# EAGLE design shield-p1000 (EAGLE 9.7.0)
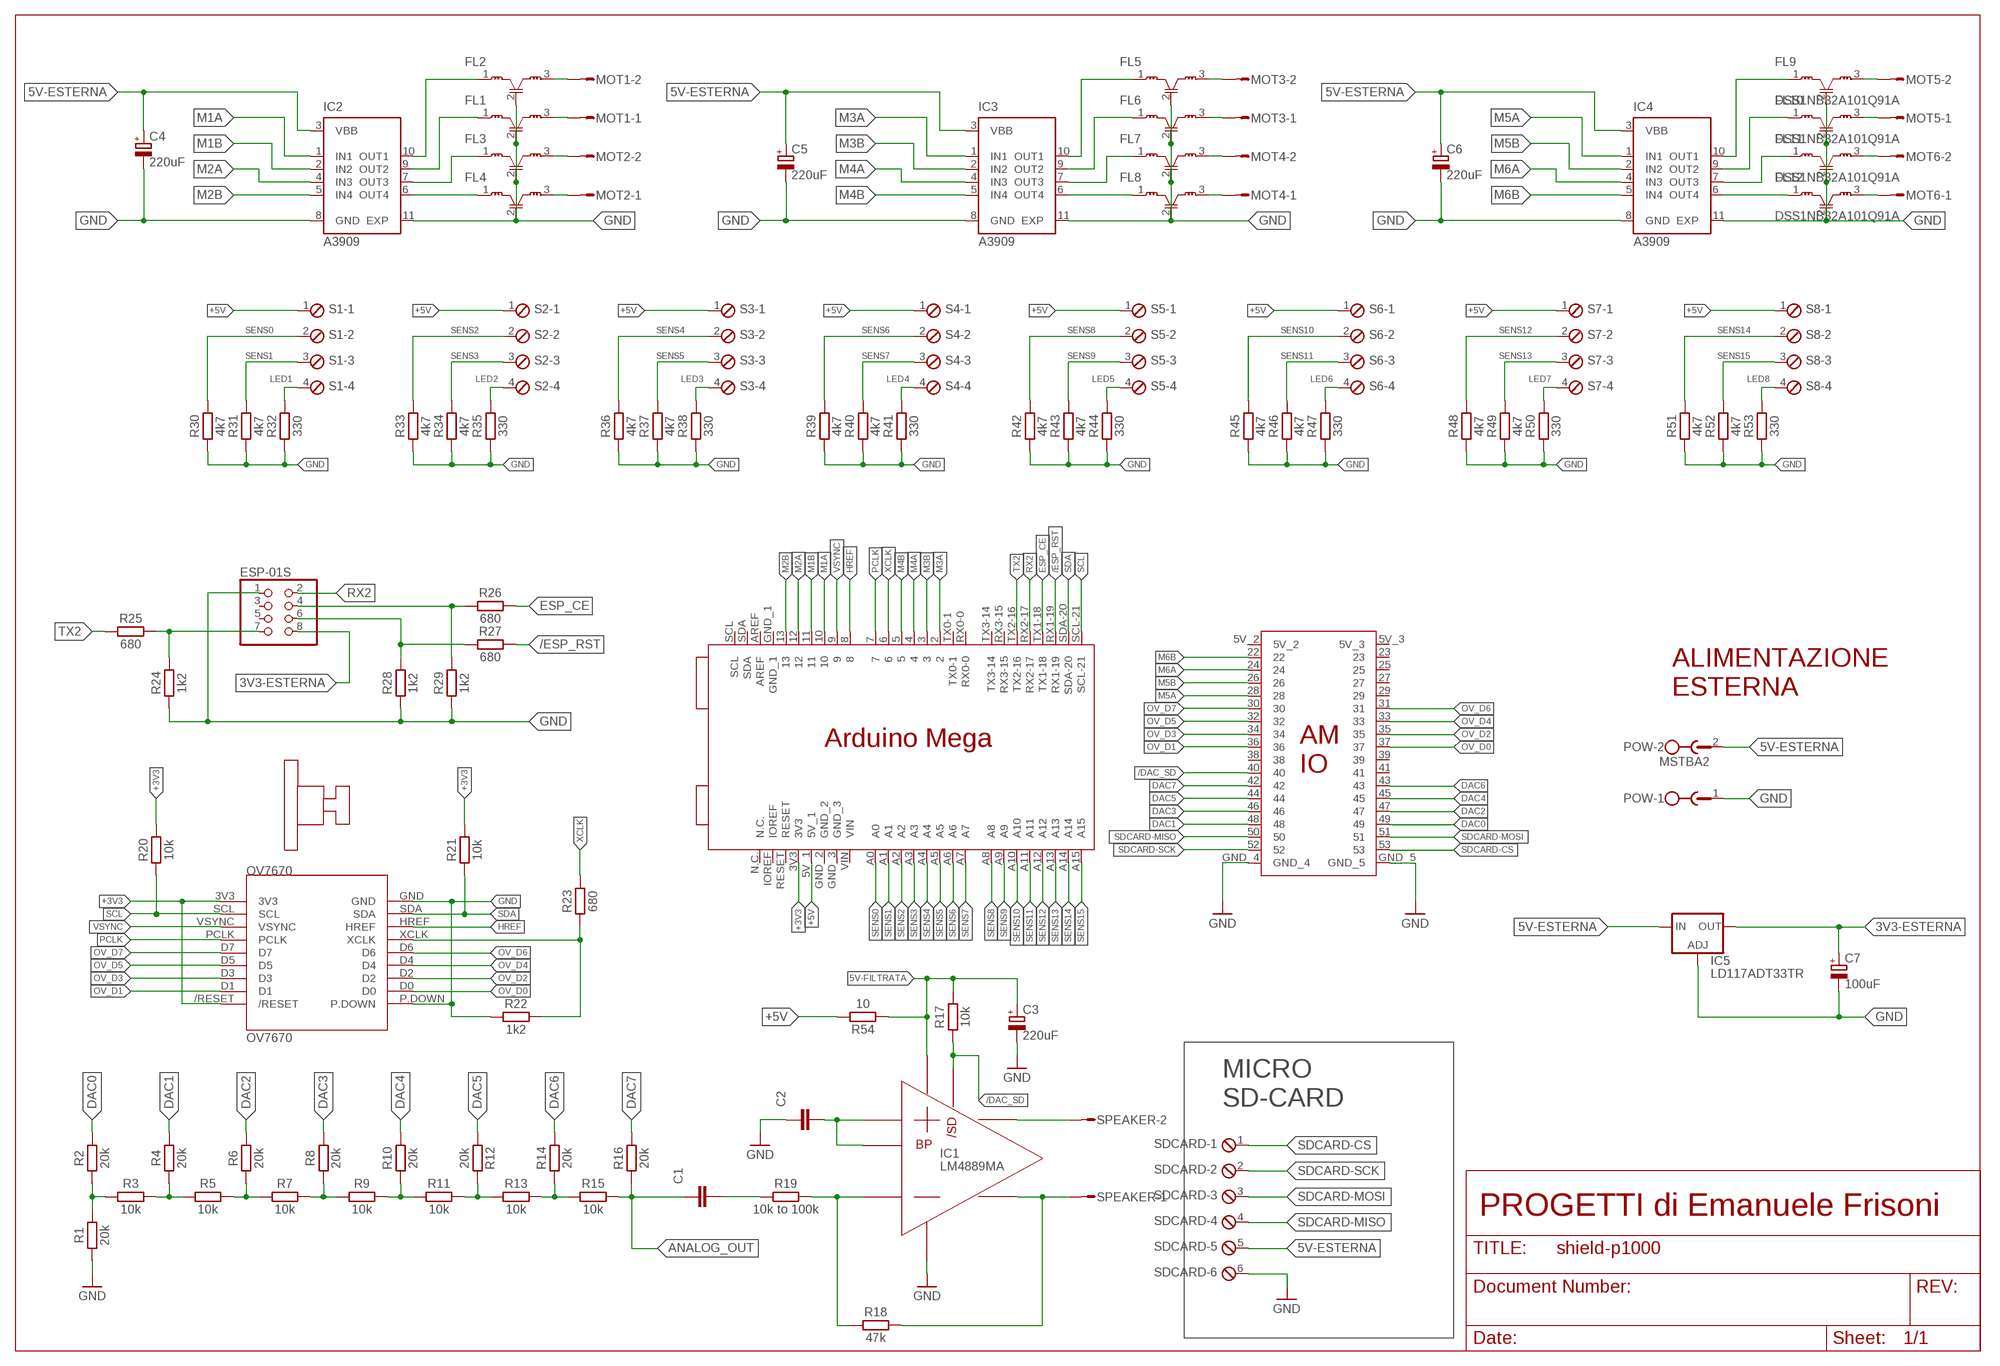
[diagram p0: schematic, sheet 1]

## Parts
ARDUINO-MEGA1  ARDUINO-MEGA-SH  [ARDUINO-MEGA-SH]
C1  1uF  C_CHIP-0603(1608-METRIC)  [CAPC1608X85]
C2  1uF  C_CHIP-0603(1608-METRIC)  [CAPC1608X85]
C3  220uF  CPOL-EUE3.5-10  [E3,5-10]
C4  220uF  CPOL-EUE3.5-10  [E3,5-10]
C5  220uF  CPOL-EUE3.5-10  [E3,5-10]
C6  220uF  CPOL-EUE3.5-10  [E3,5-10]
C7  100uF  CPOL-EUE3.5-10  [E3,5-10]
ESP-01S  PINHD-2X4  [2X04]
FL1  DSS1NB32A101Q91A  [RADIAL-3]
FL2  DSS1NB32A101Q91A  [RADIAL-3]
FL3  DSS1NB32A101Q91A  [RADIAL-3]
FL4  DSS1NB32A101Q91A  [RADIAL-3]
FL5  DSS1NB32A101Q91A  [RADIAL-3]
FL6  DSS1NB32A101Q91A  [RADIAL-3]
FL7  DSS1NB32A101Q91A  [RADIAL-3]
FL8  DSS1NB32A101Q91A  [RADIAL-3]
FL9  DSS1NB32A101Q91A  [RADIAL-3]
FL10  DSS1NB32A101Q91A  [RADIAL-3]
FL11  DSS1NB32A101Q91A  [RADIAL-3]
FL12  DSS1NB32A101Q91A  [RADIAL-3]
IC1  LM4889MA  [SOIC127P599X175-8N]
IC2  A3909  A3909LY  [10-MSOP]
IC3  A3909  A3909LY  [10-MSOP]
IC4  A3909  A3909LY  [10-MSOP]
IC5  LD117ADT33TR  [DPACK]
MOT1  S02P  [S02P]
MOT2  S02P  [S02P]
MOT3  S02P  [S02P]
MOT4  S02P  [S02P]
MOT5  S02P  [S02P]
MOT6  S02P  [S02P]
OV7670  OV7670  [OV7670-HEADER]
POW  MSTBA2  [MSTBA2]
R1  20k  R_CHIP-0603(1608-METRIC)  [RESC1608X60]
R2  20k  R_CHIP-0603(1608-METRIC)  [RESC1608X60]
R3  10k  R_CHIP-0603(1608-METRIC)  [RESC1608X60]
R4  20k  R_CHIP-0603(1608-METRIC)  [RESC1608X60]
R5  10k  R_CHIP-0603(1608-METRIC)  [RESC1608X60]
R6  20k  R_CHIP-0603(1608-METRIC)  [RESC1608X60]
R7  10k  R_CHIP-0603(1608-METRIC)  [RESC1608X60]
R8  20k  R_CHIP-0603(1608-METRIC)  [RESC1608X60]
R9  10k  R_CHIP-0603(1608-METRIC)  [RESC1608X60]
R10  20k  R_CHIP-0603(1608-METRIC)  [RESC1608X60]
R11  10k  R_CHIP-0603(1608-METRIC)  [RESC1608X60]
R12  20k  R_CHIP-0603(1608-METRIC)  [RESC1608X60]
R13  10k  R_CHIP-0603(1608-METRIC)  [RESC1608X60]
R14  20k  R_CHIP-0603(1608-METRIC)  [RESC1608X60]
R15  10k  R_CHIP-0603(1608-METRIC)  [RESC1608X60]
R16  20k  R_CHIP-0603(1608-METRIC)  [RESC1608X60]
R17  10k  R_CHIP-0603(1608-METRIC)  [RESC1608X60]
R18  47k  R_CHIP-0603(1608-METRIC)  [RESC1608X60]
R19  10k to 100k  R_AXIAL-7.2MM-PITCH  [RESAD724W46L381D178B]
R20  10k  R_CHIP-0603(1608-METRIC)  [RESC1608X60]
R21  10k  R_CHIP-0603(1608-METRIC)  [RESC1608X60]
R22  1k2  R_CHIP-0603(1608-METRIC)  [RESC1608X60]
R23  680  R_CHIP-0603(1608-METRIC)  [RESC1608X60]
R24  1k2  R_CHIP-0603(1608-METRIC)  [RESC1608X60]
R25  680  R_CHIP-0603(1608-METRIC)  [RESC1608X60]
R26  680  R_CHIP-0603(1608-METRIC)  [RESC1608X60]
R27  680  R_CHIP-0603(1608-METRIC)  [RESC1608X60]
R28  1k2  R_CHIP-0603(1608-METRIC)  [RESC1608X60]
R29  1k2  R_CHIP-0603(1608-METRIC)  [RESC1608X60]
R30  4k7  R_CHIP-0603(1608-METRIC)  [RESC1608X60]
R31  4k7  R_CHIP-0603(1608-METRIC)  [RESC1608X60]
R32  330  R_CHIP-0603(1608-METRIC)  [RESC1608X60]
R33  4k7  R_CHIP-0603(1608-METRIC)  [RESC1608X60]
R34  4k7  R_CHIP-0603(1608-METRIC)  [RESC1608X60]
R35  330  R_CHIP-0603(1608-METRIC)  [RESC1608X60]
R36  4k7  R_CHIP-0603(1608-METRIC)  [RESC1608X60]
R37  4k7  R_CHIP-0603(1608-METRIC)  [RESC1608X60]
R38  330  R_CHIP-0603(1608-METRIC)  [RESC1608X60]
R39  4k7  R_CHIP-0603(1608-METRIC)  [RESC1608X60]
R40  4k7  R_CHIP-0603(1608-METRIC)  [RESC1608X60]
R41  330  R_CHIP-0603(1608-METRIC)  [RESC1608X60]
R42  4k7  R_CHIP-0603(1608-METRIC)  [RESC1608X60]
R43  4k7  R_CHIP-0603(1608-METRIC)  [RESC1608X60]
R44  330  R_CHIP-0603(1608-METRIC)  [RESC1608X60]
R45  4k7  R_CHIP-0603(1608-METRIC)  [RESC1608X60]
R46  4k7  R_CHIP-0603(1608-METRIC)  [RESC1608X60]
R47  330  R_CHIP-0603(1608-METRIC)  [RESC1608X60]
R48  4k7  R_CHIP-0603(1608-METRIC)  [RESC1608X60]
R49  4k7  R_CHIP-0603(1608-METRIC)  [RESC1608X60]
R50  330  R_CHIP-0603(1608-METRIC)  [RESC1608X60]
R51  4k7  R_CHIP-0603(1608-METRIC)  [RESC1608X60]
R52  4k7  R_CHIP-0603(1608-METRIC)  [RESC1608X60]
R53  330  R_CHIP-0603(1608-METRIC)  [RESC1608X60]
R54  10  R_CHIP-0603(1608-METRIC)  [RESC1608X60]
S1  MPT4  [4POL254]
S2  MPT4  [4POL254]
S3  MPT4  [4POL254]
S4  MPT4  [4POL254]
S5  MPT4  [4POL254]
S6  MPT4  [4POL254]
S7  MPT4  [4POL254]
S8  MPT4  [4POL254]
SDCARD  MPT6  [6POL254]
SPEAKER  S02P  [S02P]

## Nets
3V3-ESTERNA: C7.+ ESP-01S.8 IC5.4(OUT)
5V-ESTERNA: C4.+ C5.+ C6.+ IC2.3(VBB) IC3.3(VBB) IC4.3(VBB) IC5.3(IN) POW.2 SDCARD.5
5V-FILTRATA: C3.+ IC1.6(VDD) R17.1 R54.2
+3V3: ARDUINO-MEGA1.3V3 OV7670.3V3 OV7670./RESET R20.2 R21.2
+5V: ARDUINO-MEGA1.5V_1 R54.1 S1.1 S2.1 S3.1 S4.1 S5.1 S6.1 S7.1 S8.1
/DAC_SD: ARDUINO-MEGA1.40 IC1.1(/SHUTDOWN) R17.2
/ESP_RST: ARDUINO-MEGA1.RX1-19 R27.2
ANALOG_OUT: C1.1 R15.1 R16.2
DAC0: ARDUINO-MEGA1.49 R2.1
DAC1: ARDUINO-MEGA1.48 R4.1
DAC2: ARDUINO-MEGA1.47 R6.1
DAC3: ARDUINO-MEGA1.46 R8.1
DAC4: ARDUINO-MEGA1.45 R10.1
DAC5: ARDUINO-MEGA1.44 R12.1
DAC6: ARDUINO-MEGA1.43 R14.1
DAC7: ARDUINO-MEGA1.42 R16.1
ESP_CE: ARDUINO-MEGA1.TX1-18 R26.2
GND: ARDUINO-MEGA1.GND_4 ARDUINO-MEGA1.GND_5 C2.1 C3.- C4.- C5.- C6.- C7.- ESP-01S.1 FL1.2(GND) FL2.2(GND) FL3.2(GND) FL4.2(GND) FL5.2(GND) FL6.2(GND) FL7.2(GND) FL8.2(GND) FL9.2(GND) FL10.2(GND) FL11.2(GND) FL12.2(GND) IC1.7(VSS) IC2.8(GND) IC2.11(EXP) IC3.8(GND) IC3.11(EXP) IC4.8(GND) IC4.11(EXP) IC5.1(ADJ) OV7670.GND OV7670.P.DOWN POW.1 R1.1 R22.1 R24.1 R28.1 R29.1 R30.1 R31.1 R32.1 R33.1 R34.1 R35.1 R36.1 R37.1 R38.1 R39.1 R40.1 R41.1 R42.1 R43.1 R44.1 R45.1 R46.1 R47.1 R48.1 R49.1 R50.1 R51.1 R52.1 R53.1 SDCARD.6
HREF: ARDUINO-MEGA1.8 OV7670.HREF
LED1: R32.2 S1.4
LED2: R35.2 S2.4
LED3: R38.2 S3.4
LED4: R41.2 S4.4
LED5: R44.2 S5.4
LED6: R47.2 S6.4
LED7: R50.2 S7.4
LED8: R53.2 S8.4
M1A: ARDUINO-MEGA1.10 IC2.1(IN1)
M1B: ARDUINO-MEGA1.11 IC2.2(IN2)
M2A: ARDUINO-MEGA1.12 IC2.4(IN3)
M2B: ARDUINO-MEGA1.13 IC2.5(IN4)
M3A: ARDUINO-MEGA1.2 IC3.1(IN1)
M3B: ARDUINO-MEGA1.3 IC3.2(IN2)
M4A: ARDUINO-MEGA1.4 IC3.4(IN3)
M4B: ARDUINO-MEGA1.5 IC3.5(IN4)
M5A: ARDUINO-MEGA1.28 IC4.1(IN1)
M5B: ARDUINO-MEGA1.26 IC4.2(IN2)
M6A: ARDUINO-MEGA1.24 IC4.4(IN3)
M6B: ARDUINO-MEGA1.22 IC4.5(IN4)
N$1: R1.2 R2.2 R3.2
N$2: R3.1 R4.2 R5.2
N$3: R5.1 R6.2 R7.2
N$4: R7.1 R8.2 R9.2
N$5: R9.1 R10.2 R11.2
N$6: R11.1 R12.2 R13.2
N$7: R13.1 R14.2 R15.2
N$8: IC1.8(VO2) SPEAKER.2
N$9: FL4.1 IC2.6(OUT4)
N$10: C1.2 R19.1
N$11: IC1.4(IN-) R18.2 R19.2
N$12: IC1.5(VO1) R18.1 SPEAKER.1
N$13: C2.2 IC1.2(BYPASS) IC1.3(IN+)
N$14: ESP-01S.7 R24.2 R25.2
N$15: ESP-01S.4 R26.1 R29.2
N$16: ESP-01S.6 R27.1 R28.2
N$17: FL3.1 IC2.7(OUT3)
N$18: FL1.1 IC2.9(OUT2)
N$19: FL2.1 IC2.10(OUT1)
N$20: FL2.3 MOT1.2
N$21: FL1.3 MOT1.1
N$22: FL3.3 MOT2.2
N$23: FL4.3 MOT2.1
N$24: FL8.1 IC3.6(OUT4)
N$25: FL7.1 IC3.7(OUT3)
N$26: FL6.1 IC3.9(OUT2)
N$27: FL5.1 IC3.10(OUT1)
N$28: FL5.3 MOT3.2
N$29: FL6.3 MOT3.1
N$30: FL7.3 MOT4.2
N$31: FL8.3 MOT4.1
N$32: FL12.1 IC4.6(OUT4)
N$33: FL11.1 IC4.7(OUT3)
N$34: FL10.1 IC4.9(OUT2)
N$35: FL9.1 IC4.10(OUT1)
N$36: FL9.3 MOT5.2
N$37: FL10.3 MOT5.1
N$38: FL11.3 MOT6.2
N$39: FL12.3 MOT6.1
OV_D0: ARDUINO-MEGA1.37 OV7670.D0
OV_D1: ARDUINO-MEGA1.36 OV7670.D1
OV_D2: ARDUINO-MEGA1.35 OV7670.D2
OV_D3: ARDUINO-MEGA1.34 OV7670.D3
OV_D4: ARDUINO-MEGA1.33 OV7670.D4
OV_D5: ARDUINO-MEGA1.32 OV7670.D5
OV_D6: ARDUINO-MEGA1.31 OV7670.D6
OV_D7: ARDUINO-MEGA1.30 OV7670.D7
PCLK: ARDUINO-MEGA1.7 OV7670.PCLK
RX2: ARDUINO-MEGA1.RX2-17 ESP-01S.2
SCL: ARDUINO-MEGA1.SCL-21 OV7670.SCL R20.1
SDA: ARDUINO-MEGA1.SDA-20 OV7670.SDA R21.1
SDCARD-CS: ARDUINO-MEGA1.53 SDCARD.1
SDCARD-MISO: ARDUINO-MEGA1.50 SDCARD.4
SDCARD-MOSI: ARDUINO-MEGA1.51 SDCARD.3
SDCARD-SCK: ARDUINO-MEGA1.52 SDCARD.2
SENS0: ARDUINO-MEGA1.A0 R30.2 S1.2
SENS1: ARDUINO-MEGA1.A1 R31.2 S1.3
SENS2: ARDUINO-MEGA1.A2 R33.2 S2.2
SENS3: ARDUINO-MEGA1.A3 R34.2 S2.3
SENS4: ARDUINO-MEGA1.A4 R36.2 S3.2
SENS5: ARDUINO-MEGA1.A5 R37.2 S3.3
SENS6: ARDUINO-MEGA1.A6 R39.2 S4.2
SENS7: ARDUINO-MEGA1.A7 R40.2 S4.3
SENS8: ARDUINO-MEGA1.A8 R42.2 S5.2
SENS9: ARDUINO-MEGA1.A9 R43.2 S5.3
SENS10: ARDUINO-MEGA1.A10 R45.2 S6.2
SENS11: ARDUINO-MEGA1.A11 R46.2 S6.3
SENS12: ARDUINO-MEGA1.A12 R48.2 S7.2
SENS13: ARDUINO-MEGA1.A13 R49.2 S7.3
SENS14: ARDUINO-MEGA1.A14 R51.2 S8.2
SENS15: ARDUINO-MEGA1.A15 R52.2 S8.3
TX2: ARDUINO-MEGA1.TX2-16 R25.1
VSYNC: ARDUINO-MEGA1.9 OV7670.VSYNC
XCLK: ARDUINO-MEGA1.6 R23.2
XCLK1: OV7670.XCLK R22.2 R23.1
Unconnected: ARDUINO-MEGA1.5V_2 ARDUINO-MEGA1.5V_3 ARDUINO-MEGA1.23 ARDUINO-MEGA1.25 ARDUINO-MEGA1.27 ARDUINO-MEGA1.29 ARDUINO-MEGA1.38 ARDUINO-MEGA1.39 ARDUINO-MEGA1.41 ARDUINO-MEGA1.AREF ARDUINO-MEGA1.GND_1 ARDUINO-MEGA1.GND_2 ARDUINO-MEGA1.GND_3 ARDUINO-MEGA1.IOREF ARDUINO-MEGA1.N.C. ARDUINO-MEGA1.RESET ARDUINO-MEGA1.RX0-0 ARDUINO-MEGA1.RX3-15 ARDUINO-MEGA1.SCL ARDUINO-MEGA1.SDA ARDUINO-MEGA1.TX0-1 ARDUINO-MEGA1.TX3-14 ARDUINO-MEGA1.VIN ESP-01S.3 ESP-01S.5

## Notes on the sheet
- ALIMENTAZIONE
  ESTERNA
- MICRO
  SD-CARD
- PROGETTI di Emanuele Frisoni

## Library data of the parts
ARDUINO-MEGA1 = progetto1000:ARDUINO-MEGA-SH
C1 C2 = Capacitor:C: Capacitor - Generic; CATEGORY: Capacitor
C3-C7 = rcl:CPOL-EU: POLARIZED CAPACITOR, European symbol; SPICEPREFIX: C
ESP-01S = pinhead:PINHD-2X4: PIN HEADER
FL1-FL12 = Filters:DSS1NB32A101Q91A: FILTER LC(T) 100PF TH Manufacturer's datasheet <https://media.digikey.com/pdf/Data%20Sheets/Murata%20PDFs/DSS1NB3_Spec.pdf>; CREATED_BY: PCBLayout.com; DIGIKEY_PN: 490-9787-3-ND; MANUFACTURER: Murata Electronics; MPN: DSS1NB32A101Q91A; PACKAGE: RADIAL
IC1 = progetto1000:LM4889
IC2-IC4 = allegro:A3909
IC5 = v-reg:LD117A?*: Low drop fixed and adjustable positive voltage regulators 1 A Source: http://www.st.com/stonline/products/literature/ds/7194/ld1117axx.pdf
MOT1-MOT6 SPEAKER = con-amp-mt:S02P: AMP MT CONNECTOR; OC_FARNELL: unknown; OC_NEWARK: unknown
OV7670 = progetto1000:OV7670
POW = con-phoenix-508:MSTBA2: PHOENIX; MF: FARNELL; MPN: 1757242; OC_FARNELL: 3705171; OC_NEWARK: 71C4161
R1-R54 = Resistor:R: Resistor Fixed - Generic; CATEGORY: Resistor; SUB-CATEGORY: Fixed
S1-S8 = con-phoenix-254-custom:MPT4: PHOENIX CONNECTOR; OC_FARNELL: unknown; OC_NEWARK: unknown
SDCARD = con-phoenix-254:MPT6: PHOENIX CONNECTOR; OC_FARNELL: unknown; OC_NEWARK: unknown

## Board
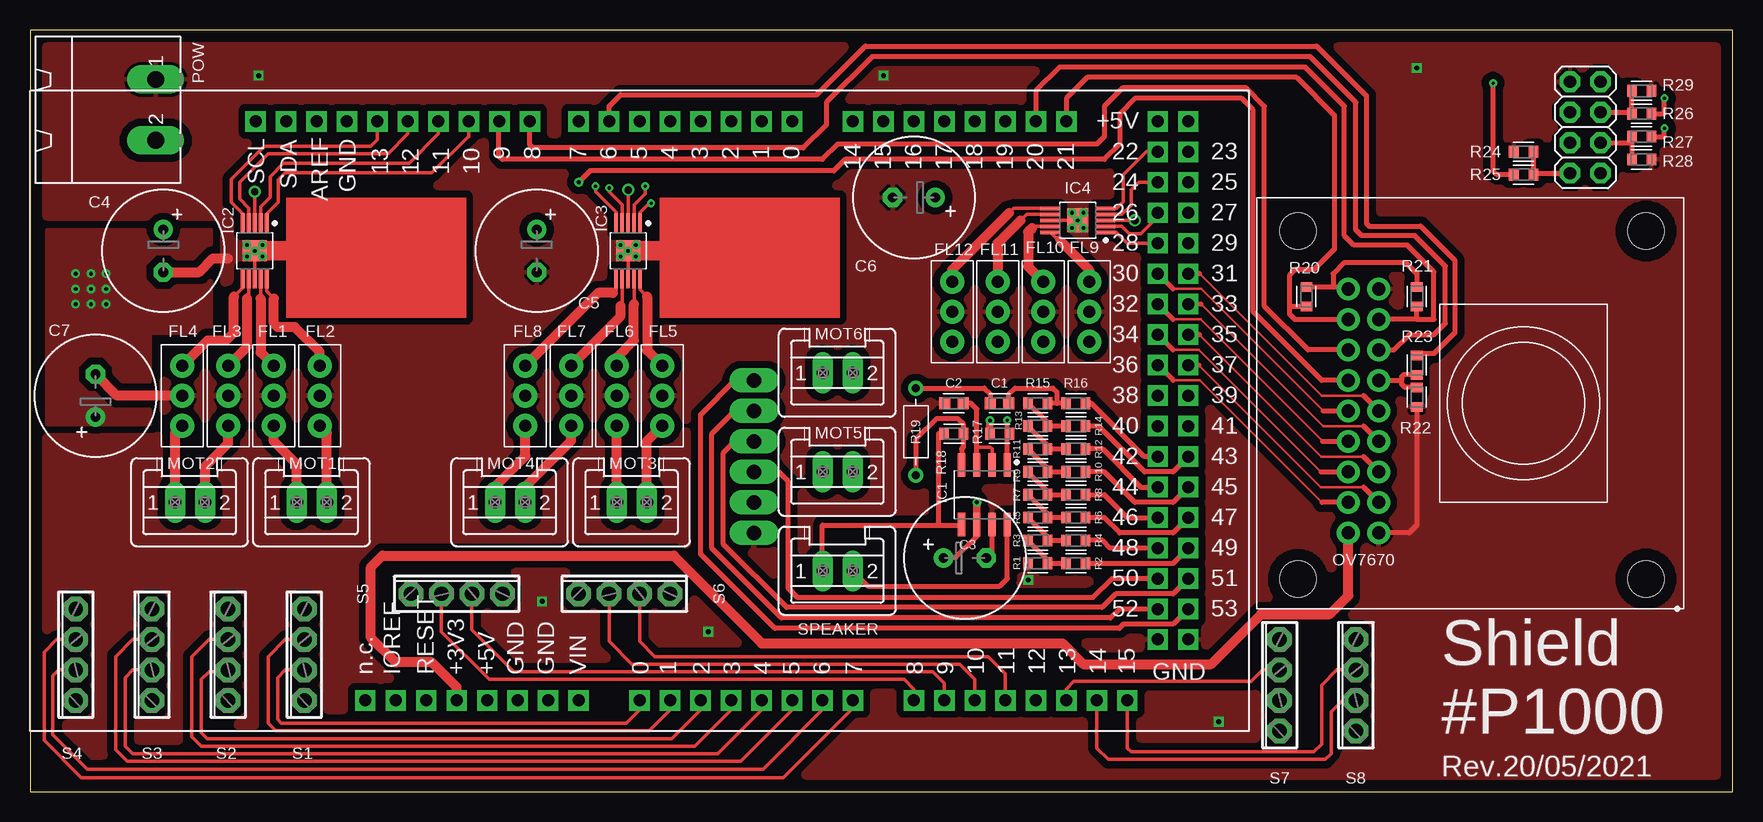
[diagram p1: board, top side]
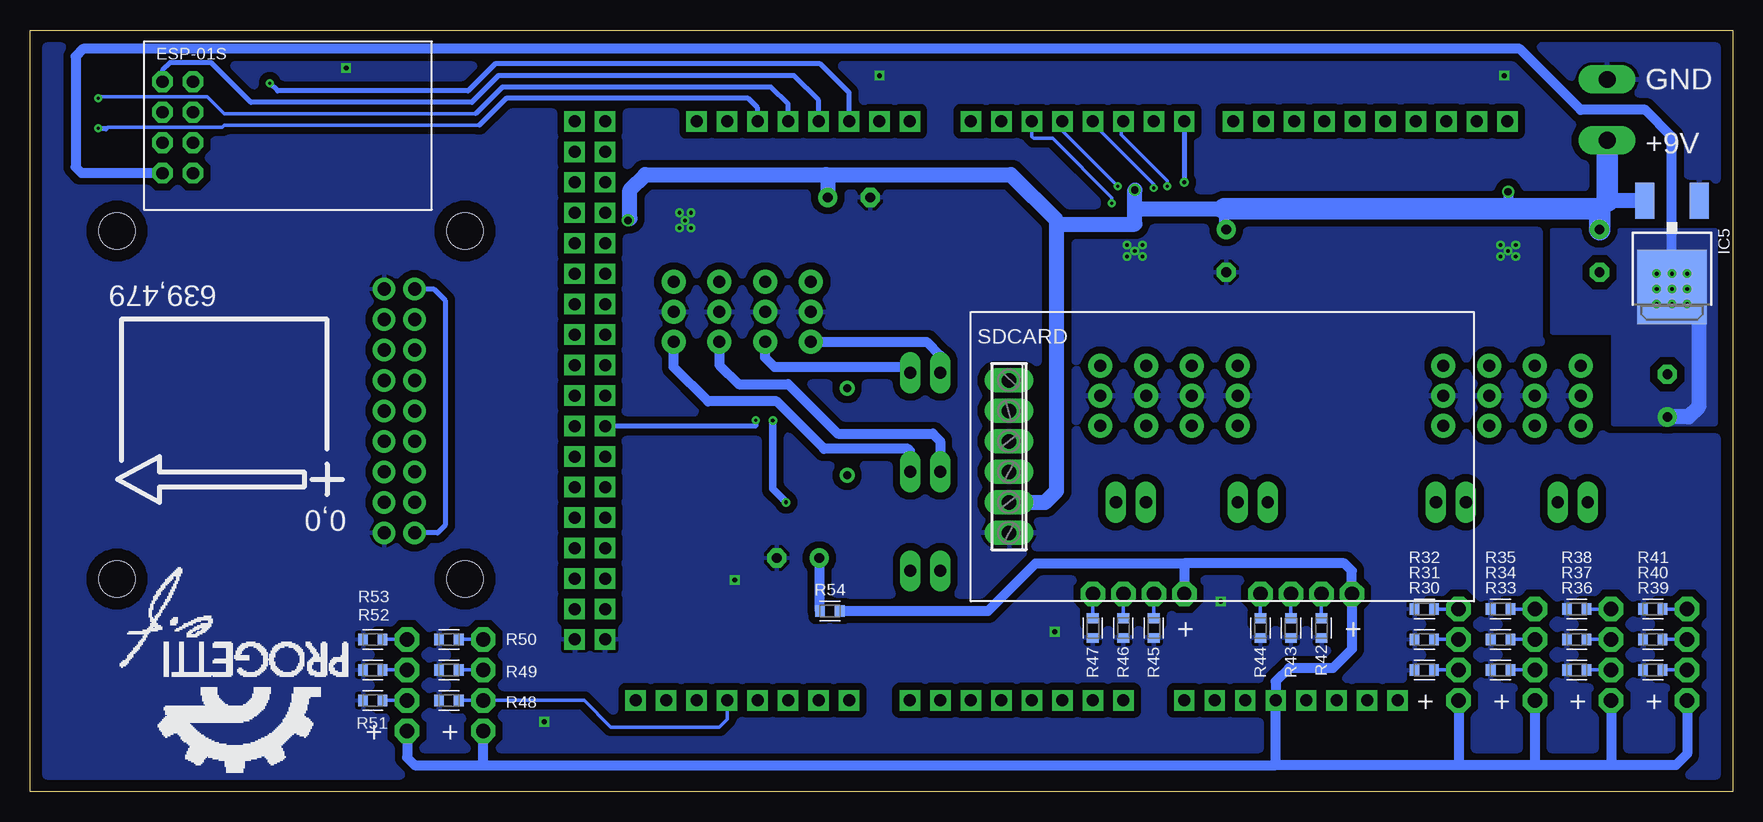
[diagram p2: board, bottom side, seen from below]

Size 141.91 x 63.49 mm. Coordinates in mm from the lower left corner, seen from the top.
Outline: 0,0 141.91,0 141.91,63.49 0,63.49 0,0
Copper layers (1*16): Top 0.07mm / dielectric 1.5mm / Bottom 0.07mm
Design rules "default *": minimum track width 6mil, minimum drill 0.2mm, track to track 6mil, track to pad 6mil, pad to pad 6mil, via to via 6mil, smd to smd 6mil, copper to edge 40mil, drill to drill 6mil, minimum pad ring 10mil, minimum via ring 8mil, stop-mask expansion 4mil, vias tented up to drill 0mil, thermal gap 10mil

### Footprints (pad centres in the part's own frame; a part is rotated, then mirrored left to right if it is on the bottom)
ARDUINO-MEGA-SH = drill 1 square: 2 58.42,50.8; 3 55.88,50.8; 3V3 35.56,2.54; 4 53.34,50.8; 5 50.8,50.8; 5V_1 38.1,2.54; 5V_2 93.98,50.8; 5V_3 96.52,50.8; 6 48.26,50.8; 7 45.72,50.8; 8 41.656,50.8; 9 39.116,50.8; 10 36.576,50.8; 11 34.036,50.8; 12 31.496,50.8; 13 28.956,50.8; 22 93.98,48.26; 23 96.52,48.26; 24 93.98,45.72; 25 96.52,45.72; 26 93.98,43.18; 27 96.52,43.18; 28 93.98,40.64; 29 96.52,40.64; 30 93.98,38.1; 31 96.52,38.1; 32 93.98,35.56; 33 96.52,35.56; 34 93.98,33.02; 35 96.52,33.02; 36 93.98,30.48; 37 96.52,30.48; 38 93.98,27.94; 39 96.52,27.94; 40 93.98,25.4; 41 96.52,25.4; 42 93.98,22.86; 43 96.52,22.86; 44 93.98,20.32; 45 96.52,20.32; 46 93.98,17.78; 47 96.52,17.78; 48 93.98,15.24; 49 96.52,15.24; 50 93.98,12.7; 51 96.52,12.7; 52 93.98,10.16; 53 96.52,10.16; A0 50.8,2.54; A1 53.34,2.54; A2 55.88,2.54; A3 58.42,2.54; A4 60.96,2.54; A5 63.5,2.54; A6 66.04,2.54; A7 68.58,2.54; A8 73.66,2.54; A9 76.2,2.54; A10 78.74,2.54; A11 81.28,2.54; A12 83.82,2.54; A13 86.36,2.54; A14 88.9,2.54; A15 91.44,2.54; AREF 23.876,50.8; GND_1 26.416,50.8; GND_2 40.64,2.54; GND_3 43.18,2.54; GND_4 93.98,7.62; GND_5 96.52,7.62; IOREF 30.48,2.54; N.C. 27.94,2.54; RESET 33.02,2.54; RX0-0 63.5,50.8; RX1-19 81.28,50.8; RX2-17 76.2,50.8; RX3-15 71.12,50.8; SCL 18.796,50.8; SCL-21 86.36,50.8; SDA 21.336,50.8; SDA-20 83.82,50.8; TX0-1 60.96,50.8; TX1-18 78.74,50.8; TX2-16 73.66,50.8; TX3-14 68.58,50.8; VIN 45.72,2.54
CAPC1608X85 = smd 0.921 x 0.97: 1 -0.775,0; 2 0.775,0
E3,5-10 = drill 0.813 pad 1.6: + -1.778,0 | drill 0.813 pad 1.6 octagon: - 1.778,0
2X04 = drill 1.016 octagon: 1 -3.81,-1.27; 2 -3.81,1.27; 3 -1.27,-1.27; 4 -1.27,1.27; 5 1.27,-1.27; 6 1.27,1.27; 7 3.81,-1.27; 8 3.81,1.27
RADIAL-3 = drill 1 pad 2: 1 -2.5,0; 2 0,0; 3 2.5,0
SOIC127P599X175-8N = smd 1.965 x 0.602: 1 -2.47,1.905; 2 -2.47,0.635; 3 -2.47,-0.635; 4 -2.47,-1.905; 5 2.47,-1.905; 6 2.47,-0.635; 7 2.47,0.635; 8 2.47,1.905
10-MSOP = smd 1.65 x 0.3: 1 -2.3,1; 2 -2.3,0.5; 3 -2.3,0; 4 -2.3,-0.5; 5 -2.3,-1; 6 2.3,-1; 7 2.3,-0.5; 8 2.3,0; 9 2.3,0.5; 10 2.3,1 | smd 1.73 x 2: 11 0,0
DPACK = smd 1.6 x 3: 1 -2.28,-4.8; 3 2.28,-4.8 | smd 5.8 x 6.2: 4 0,2.38
S02P = drill 1.016 long: 1 1.25,0; 2 -1.25,0
OV7670-HEADER = drill 1.105 pad 1.705: 3V3 20.32,0; /RESET 0,0; D0 2.54,-2.54; D1 2.54,0; D2 5.08,-2.54; D3 5.08,0; D4 7.62,-2.54; D5 7.62,0; D6 10.16,-2.54; D7 10.16,0; GND 20.32,-2.54; HREF 15.24,-2.54; P.DOWN 0,-2.54; PCLK 12.7,0; SCL 17.78,0; SDA 17.78,-2.54; VSYNC 15.24,0; XCLK 12.7,-2.54 | hole 3: -3.854,4.191; 25.146,4.191; 25.146,-24.809; -3.854,-24.809
MSTBA2 = drill 1.397 long: 1 -2.54,5.08; 2 2.54,5.08
RESC1608X60 = smd 0.799 x 0.974: 1 -0.815,0; 2 0.815,0
RESAD724W46L381D178B = drill 0.66 pad 1.26: 1 -3.62,0; 2 3.62,0
4POL254 = drill 1.2 octagon: 1 -3.81,0; 2 -1.27,0; 3 1.27,0; 4 3.81,0
6POL254 = drill 1.2 pad 1.778 long: 1 -6.35,0; 2 -3.81,0; 3 -1.27,0; 4 1.27,0; 5 3.81,0; 6 6.35,0

### Placement (x,y rotation side)
ARDUINO-MEGA1  0,5.08 0 top
C1  80.8,32.38 180 top
C2  76.99,32.38 0 top
C3  77.91,19.49 0 top
C4  11.11,45.09 270 top
C5  42.23,45.09 270 top
C6  73.66,49.53 180 top
C7  5.46,33.02 90 top
ESP-01S  129.6,55.37 270 top
FL1  20.32,33.02 270 top
FL2  24.13,33.02 270 top
FL3  16.51,33.02 270 top
FL4  12.7,33.02 270 top
FL5  52.7,33.02 270 top
FL6  48.9,33.02 270 top
FL7  45.09,33.02 270 top
FL8  41.27,33.02 270 top
FL9  88.27,40 270 top
FL10  84.45,40 270 top
FL11  80.64,40 270 top
FL12  76.83,40 270 top
IC1  79.53,24.77 270 top
IC2  18.73,45.09 270 top
IC3  49.85,45.09 270 top
IC4  87.31,47.62 180 top
IC5  5.08,44.45 180 bottom
MOT1  23.5,24.13 180 top
MOT2  13.34,24.13 180 top
MOT3  50.16,24.13 180 top
MOT4  40.01,24.13 180 top
MOT5  67.31,26.67 180 top
MOT6  67.31,34.92 180 top
OV7670  109.86,21.59 90 top
POW  5.4,56.83 270 top
R1  83.98,19.05 0 top
R2  87.15,19.05 180 top
R3  83.98,20.95 180 top
R4  87.15,20.95 180 top
R5  83.98,22.86 180 top
R6  87.15,22.86 180 top
R7  83.98,24.77 180 top
R8  87.15,24.77 180 top
R9  83.98,26.67 180 top
R10  87.15,26.67 180 top
R11  83.98,28.58 180 top
R12  87.15,28.58 180 top
R13  83.98,30.48 180 top
R14  87.15,30.48 180 top
R15  83.98,32.38 180 top
R16  87.15,32.38 180 top
R17  80.8,29.84 0 top
R18  76.99,29.84 0 top
R19  73.82,30 270 top
R20  106.36,41.27 90 top
R21  115.57,41.27 90 top
R22  115.57,32.89 90 top
R23  115.57,35.56 90 top
R24  124.46,53.34 0 top
R25  124.46,51.43 0 top
R26  134.3,56.52 0 top
R27  134.3,54.61 0 top
R28  134.3,52.7 180 top
R29  134.3,58.42 180 top
R30  25.72,10.16 0 bottom
R31  25.72,12.7 0 bottom
R32  25.72,15.24 0 bottom
R33  19.37,10.16 0 bottom
R34  19.37,12.7 0 bottom
R35  19.37,15.24 0 bottom
R36  13.02,10.16 0 bottom
R37  13.02,12.7 0 bottom
R38  13.02,15.24 0 bottom
R39  6.67,10.16 0 bottom
R40  6.67,12.7 0 bottom
R41  6.67,15.24 0 bottom
R42  34.29,13.65 90 bottom
R43  36.83,13.65 90 bottom
R44  39.37,13.65 90 bottom
R45  48.26,13.65 90 bottom
R46  50.8,13.65 90 bottom
R47  53.34,13.65 90 bottom
R48  107,7.62 0 bottom
R49  107,10.16 0 bottom
R50  107,12.7 0 bottom
R51  113.35,7.62 0 bottom
R52  113.35,10.16 0 bottom
R53  113.35,12.7 0 bottom
R54  75.25,15.08 180 bottom
S1  22.86,11.43 90 top
S2  16.51,11.43 90 top
S3  10.16,11.43 90 top
S4  3.81,11.43 90 top
S5  35.56,16.51 0 top
S6  49.53,16.51 0 top
S7  104.14,8.89 90 top
S8  110.49,8.89 90 top
SDCARD  60.33,27.94 270 bottom
SPEAKER  67.31,18.41 180 top

### Tracks (layer width: path | path; a pad name or v marks a point on that pad's centre or on a via)
3V3-ESTERNA  (via drill 0.3)
  Bottom 0.813: IC5.4 v5.08,43.18 5.08,54.61 7.3,56.83 12.7,56.83 17.78,61.91 137.48,61.91 138.11,61.28 138.11,52.07 137.64,51.59 130.91,51.59 ESP-01S.8
  Bottom 1.27: IC5.4 2.86,39.85 2.86,32.07 3.68,31.24 C7.+
  other vias: 3.81,43.18 6.35,43.18 6.35,41.91 5.08,41.91 3.81,41.91 3.81,40.64 5.08,40.64 6.35,40.64
  pour Bottom (isolate 0.61, no thermals): 1.27,46.99 1.27,30.48 10.16,30.48 10.16,38.1 15.24,38.1 15.24,46.99
  pour Top (isolate 0.61, no thermals): 1.27,46.99 1.27,30.48 10.16,30.48 10.16,38.1 15.24,38.1 15.24,46.99
5V-ESTERNA  (via drill 0.61)
  Top 0.305: IC4.3 v92.08,47.62 | v18.73,50.01 IC2.3 | IC3.3 v49.85,50.16
  Bottom 0.813: v92.08,47.62 91.92,47.78 | 75.56,51.43 75.44,51.31 | 56.36,47.62 56.36,47.47 | C5.+ 42.39,47.02 42.39,48.58 | v18.73,50.01 18.73,48.58
  Bottom 1.27: 91.92,47.78 91.92,50.16 90.65,51.43 75.56,51.43 60.17,51.43 56.36,47.62 | 75.44,51.31 C6.+ | 56.36,47.31 49.85,47.31 49.85,48.58 | 49.85,48.58 v49.85,50.16 | 49.85,48.58 42.39,48.58 | POW.2 10.48,49.25 IC5.3 | 11.11,48.58 10.48,49.21 | SDCARD.5 57.31,24.13 56.36,25.08 56.36,47.31 | 56.36,47.31 56.36,47.47
  Bottom 1.778: 42.39,48.58 18.73,48.58 11.11,48.58 C4.+ | 10.48,49.21 POW.2
5V-FILTRATA  (via drill 0.3)
  Top 0.305: IC1.6 78.9,21.27
  Top 0.406: 78.9,21.27 77.12,19.49 C3.+
  Top 0.61: R17.1 79.99,30.94 v80.01,30.96 | v78.9,24.13 IC1.6
  Bottom 0.61: v80.01,30.96 80.01,25.24 v78.9,24.13
  Bottom 0.813: C3.+ 76.13,15.15 R54.2
+3V3
  Top 0.406: R20.2 108.58,42.09 | 108.58,42.09 109.67,42.09 OV7670.3V3 | R21.2 115.57,43.18 114.62,44.13 109.54,44.13 108.58,43.18 108.58,42.09
  Top 0.813: ARDUINO-MEGA1.3V3 35.56,8.73 33.5,10.79 30.48,10.79 28.42,12.86 28.42,18.73 29.37,19.69 53.66,19.69 60.96,12.38 86.04,12.38 87.79,10.64 98.42,10.64 102.6,14.81 108.32,14.81 109.86,16.35 OV7670./RESET
  Bottom 0.406: OV7670.3V3 108.27,41.91 107.31,40.96 107.31,22.23 107.95,21.59 OV7670./RESET
+5V
  Bottom 0.813: 10.16,2.22 4.76,2.22 3.81,3.17 S4.1 | 10.16,2.22 16.51,2.22 | 16.51,2.22 23.02,2.22 | 23.02,2.22 38.1,2.22 | 38.1,2.22 ARDUINO-MEGA1.5V_1 38.1,9.21 36.99,10.32 33.34,10.32 31.75,11.91 S5.1 31.75,18.41 32.38,19.05 45.72,19.05 | 45.72,19.05 S6.1 | S8.1 110.49,2.86 109.86,2.22 103.98,2.22 | S7.1 104.14,2.38 103.98,2.22 | 103.98,2.22 38.1,2.22 | S3.1 10.16,2.22 | S2.1 16.51,2.22 | S1.1 22.86,2.38 23.02,2.22 | R54.1 62.07,15.08 58.1,19.05 45.72,19.05
/DAC_SD  (via drill 0.25)
  Top 0.406: IC1.1 81.44,29.66 R17.2 81.44,30.02 v81.44,30.96
  Bottom 0.406: v81.44,30.96 81.44,30.48 ARDUINO-MEGA1.40
/ESP_RST  (via drill 0.25)
  Top 0.406: R27.2 136.21,54.61 v136.21,55.3
  Bottom 0.305: 104.46,55.56 125.73,55.56 125.89,55.4 135.41,55.4 135.57,55.24
  Bottom 0.406: ARDUINO-MEGA1.RX1-19 81.28,56.99 82.07,57.78 102.23,57.78 104.46,55.56 | 135.57,55.24 136.16,55.24 v136.21,55.3
ANALOG_OUT
  Top 0.406: R16.2 85.57,32.38 | 85.57,32.38 R15.1 | C1.1 81.58,33.16 82.07,33.66 85.25,33.66 85.57,33.34 85.57,32.38
DAC0
  Top 0.406: ARDUINO-MEGA1.49 95.25,19.05 R2.1
DAC1
  Top 0.406: R4.1 89.38,20.95 90.02,20.32 ARDUINO-MEGA1.48
DAC2
  Top 0.406: ARDUINO-MEGA1.47 95.25,21.59 90.81,21.59 89.53,22.86 R6.1
DAC3
  Top 0.406: ARDUINO-MEGA1.46 91.44,22.86 89.53,24.77 R8.1
DAC4
  Top 0.406: ARDUINO-MEGA1.45 95.25,24.13 92.08,24.13 89.53,26.67 R10.1
DAC5
  Top 0.406: R12.1 89.38,28.58 92.56,25.4 ARDUINO-MEGA1.44
DAC6
  Top 0.406: ARDUINO-MEGA1.43 95.25,26.67 92.89,26.67 89.08,30.48 R14.1
DAC7
  Top 0.406: ARDUINO-MEGA1.42 92.87,27.94 88.42,32.38 R16.1
ESP_CE  (via drill 0.25)
  Top 0.406: R26.2 136.21,56.52 v136.21,57.78
  Bottom 0.305: 104.78,56.52 125.73,56.52 127.16,57.94 136.05,57.94 v136.21,57.78
  Bottom 0.406: ARDUINO-MEGA1.TX1-18 78.74,57.31 80.17,58.74 102.55,58.74 104.78,56.52
GND  (via drill 0.3, 0.41)
  Top 0.305: IC4.8 IC4.11 | IC3.11 IC3.8 | IC2.8 IC2.11
  Top 0.406: IC1.7 80.17,19.79 C3.- | R22.1 115.57,22.23 114.94,21.59 OV7670.P.DOWN
  Top 0.813: FL4.2 7.24,33.02 C7.- | C4.- 14.1,43.31 15.24,44.45 16.51,44.45
  other vias: 18.73,45.09 18.1,45.56 19.37,45.56 18.1,44.61 19.37,44.61 49.85,45.09 49.21,45.56 50.48,45.56 49.21,44.61 50.48,44.61 87.31,47.62 86.84,48.26 87.79,48.26 86.84,46.99 87.79,46.99 71.12,59.69 19.05,59.69 115.57,60.32 99.06,5.84 42.67,15.88 56.52,13.34 83.19,17.65
  pour Bottom (isolate 0.61, rank 2): -0.16,-0.16 141.92,-0.16 141.92,63.5 -0.16,63.5
  pour Top (isolate 0.61, rank 2): 0,0 142.24,0 142.24,63.5 0,63.5
HREF
  Top 0.406: OV7670.HREF 113.67,36.83 114.94,38.1 117,38.1 117.95,39.05 117.95,43.81 115.41,46.35 110.97,46.35 110.49,46.83 110.49,57.47 106.68,61.28 70.17,61.28 66.36,57.47 66.36,55.56 64.45,53.66 41.91,53.66 41.66,53.91 ARDUINO-MEGA1.8
LED1
  Bottom 0.305: R32.2 S1.4
LED2
  Bottom 0.305: R35.2 S2.4
LED3
  Bottom 0.305: R38.2 S3.4
LED4
  Bottom 0.305: R41.2 S4.4
LED5
  Bottom 0.305: R44.2 S5.4
LED6
  Bottom 0.305: R47.2 S6.4
LED7
  Bottom 0.305: R50.2 S7.4
LED8
  Bottom 0.305: R53.2 S8.4
M1A
  Top 0.305: IC2.1 19.73,48.18 20.68,49.13 20.68,51.01 21.27,51.59 33.5,51.59 36.54,54.64 36.58,54.61 ARDUINO-MEGA1.10
M1B
  Top 0.305: ARDUINO-MEGA1.11 34.04,54.83 31.59,52.39 21.11,52.39 20,51.28 20,49.54 19.23,48.77 IC2.2
M2A
  Top 0.305: ARDUINO-MEGA1.12 31.5,54.83 29.84,53.18 19.84,53.18 17.46,50.8 17.46,49.41 18.23,48.64 IC2.4
M2B
  Top 0.305: IC2.5 17.73,48.18 16.78,49.13 16.78,51.07 19.53,53.82 28.42,53.82 28.96,54.36 ARDUINO-MEGA1.13
M3A  (via drill 0.25)
  Top 0.305: IC3.1 50.85,48.31 51.59,49.05 v51.75,49.05
  Bottom 0.305: ARDUINO-MEGA1.2 58.42,54.61 58.26,54.45 56.67,54.45 51.75,49.53 v51.75,49.05
M3B  (via drill 0.25)
  Top 0.305: IC3.2 50.35,48.92 51.28,49.85 v51.28,50.48
  Bottom 0.305: v51.28,50.48 55.88,55.09 ARDUINO-MEGA1.3
M4A  (via drill 0.25)
  Top 0.305: IC3.4 49.35,48.92 48.26,50.01 v48.26,50.32
  Bottom 0.305: v48.26,50.32 48.26,50.64 52.7,55.09 52.7,55.24 ARDUINO-MEGA1.4
M4B  (via drill 0.25)
  Top 0.305: IC3.5 48.85,48.28 47.12,50.01 v47.12,50.48
  Bottom 0.305: ARDUINO-MEGA1.5 50.96,55.72 50.96,54.77 47.12,50.93 v47.12,50.48
M5A
  Top 0.305: IC4.1 90.53,46.62 91.44,45.72 ARDUINO-MEGA1.28
M5B
  Top 0.305: IC4.2 90.99,47.12 91.6,46.51 92.55,46.51 93.5,47.47 93.5,48.1 93.66,48.26 ARDUINO-MEGA1.26
M6A
  Top 0.305: IC4.4 90.99,48.12 91.76,48.89 91.76,50.16 92.39,50.8 ARDUINO-MEGA1.24
M6B
  Top 0.305: IC4.5 90.56,48.62 91.12,49.18 91.12,51.43 93.03,53.34 ARDUINO-MEGA1.22
N$1
  Top 0.406: R3.2 84.79,19.32 R1.2 R2.2
N$2
  Top 0.406: R5.2 84.79,21.23 R3.1 R4.2
N$3
  Top 0.406: R7.2 84.79,23.13 R5.1 R6.2
N$4
  Top 0.406: R9.2 84.79,25.04 R7.1 R8.2
N$5
  Top 0.406: R11.2 84.79,26.95 R9.1 R10.2
N$6
  Top 0.406: R13.2 84.79,28.85 R11.1 R12.2
N$7
  Top 0.406: R15.2 84.79,30.76 R13.1 R14.2
N$8
  Top 0.406: IC1.8 81.44,17.78 80.8,17.14 69.83,17.14 SPEAKER.2
N$9
  Top 0.305: IC2.6 17.73,42.02 16.99,41.27
  Top 0.813: FL4.1 14.8,37.62 16.35,37.62 16.99,38.26 16.99,41.27
N$10
  Top 0.406: C1.2 80.03,33.16 79.53,33.66 74.14,33.66 74.11,33.62 R19.1
N$11
  Top 0.406: IC1.4 77.63,28.58 77.81,28.76 R18.2 77.81,30.62 77.31,31.12 75.56,31.12 73.82,29.37 R19.2
N$12
  Top 0.406: SPEAKER.1 65.96,19.58 66.04,19.05 66.04,22.23 75.72,22.23 | 75.72,22.23 77.63,22.23 IC1.5 | R18.1 75.72,29.84 75.72,22.23
N$13
  Top 0.305: IC1.2 80.17,28.58 80.01,28.73 78.9,28.73
  Top 0.406: IC1.3 78.9,28.73 78.9,31.89 78.4,32.38 C2.2
N$14
  Top 0.406: R24.2 R25.2 125.28,51.56 ESP-01S.7
N$15
  Top 0.406: ESP-01S.4 133.49,56.64 R26.1 R29.2
N$16
  Top 0.406: ESP-01S.6 133.49,54.1 R27.1 R28.2
N$17
  Top 0.305: IC2.7 18.23,41.25 18.1,41.12
  Top 0.813: FL3.1 18.1,37.11 18.1,41.12
N$18
  Top 0.305: IC2.9 19.23,41.14 19.21,41.12
  Top 0.813: FL1.1 19.21,36.63 19.21,41.12
N$19
  Top 0.305: IC2.10 19.73,41.7 20.32,41.12
  Top 0.813: FL2.1 24.13,36.67 22.07,38.73 20.64,38.73 20.32,39.05 20.32,41.12
N$20
  Top 0.813: MOT1.2 24.75,29.91 FL2.3
N$21
  Top 0.813: MOT1.1 22.25,27.28 20.32,29.21 FL1.3
N$22
  Top 0.813: MOT2.2 14.59,27.13 16.51,29.05 FL3.3
N$23
  Top 0.813: MOT2.1 12.09,29.91 FL4.3
N$24
  Top 0.305: IC3.6 48.85,41.86 48.58,41.59
  Top 0.813: FL8.1 47.35,41.59 48.58,41.59
N$25
  Top 0.305: IC3.7 49.35,40.62 49.21,40.48
  Top 0.813: FL7.1 49.21,39.65 49.21,40.48
N$26
  Top 0.305: IC3.9 50.35,40.66 50.32,40.64
  Top 0.813: FL6.1 48.9,36.2 50.32,37.62 50.32,40.64
N$27
  Top 0.305: IC3.10 50.85,41.86 51.44,41.27
  Top 0.813: FL5.1 51.44,36.79 51.44,41.27
N$28
  Top 0.813: MOT3.2 51.41,29.23 FL5.3
N$29
  Top 0.813: MOT3.1 48.91,30.5 FL6.3
N$30
  Top 0.813: MOT4.2 41.26,25.42 45.09,29.25 FL7.3
N$31
  Top 0.813: MOT4.1 38.76,25.46 41.27,27.98 FL8.3
N$32
  Top 0.305: IC4.6 81.96,48.62 81.6,48.26
  Top 0.813: 81.6,48.26 76.83,43.5 FL12.1
N$33
  Top 0.305: IC4.7 83.05,48.12 82.55,47.62
  Top 0.813: 82.55,47.62 80.64,45.72 FL11.1
N$34
  Top 0.305: IC4.9 83.64,47.12 83.5,46.99
  Top 0.813: 83.5,46.99 83.19,46.67 83.19,43.77 FL10.1
N$35
  Top 0.305: IC4.10 85.6,46.04 85.72,46.04
  Top 0.61: 85.72,46.04 86.04,45.72
  Top 0.813: 86.04,45.72 88.27,43.5 FL9.1
N$36
  Bottom 0.813: MOT5.2 68.58,26.69 68.58,28.42 68.74,28.58 75.72,28.58 79.69,32.54 85.41,32.54 88.27,35.4 FL9.3
N$37
  Bottom 0.813: FL10.3 84.45,35.56 82.87,33.97 78.74,33.97 74.61,29.84 66.67,29.84 66.06,29.23 MOT5.1
N$38
  Bottom 0.813: MOT6.2 69.04,35.4 79.85,35.4 80.64,36.2 FL11.3
N$39
  Bottom 0.813: FL12.3 67.19,37.5 66.04,36.35 66.04,34.95 MOT6.1
OV_D0
  Top 0.203: 97.41,35.56 107.57,25.4 111.12,25.4
  Top 0.406: 111.12,25.4 OV7670.D0 | ARDUINO-MEGA1.37 97.41,35.56
OV_D1
  Top 0.203: 95.25,34.29 97.5,34.29 107.66,24.13
  Top 0.406: 95.25,34.29 ARDUINO-MEGA1.36 | OV7670.D1 107.66,24.13
OV_D2
  Top 0.203: 111.12,27.94 107.6,27.94 97.44,38.1
  Top 0.406: OV7670.D2 111.12,27.94 | 97.44,38.1 ARDUINO-MEGA1.35
OV_D3
  Top 0.203: 95.25,36.83 97.41,36.83 107.57,26.67
  Top 0.406: ARDUINO-MEGA1.34 95.25,36.83 | 107.57,26.67 OV7670.D3
OV_D4
  Top 0.203: 111.12,30.48 107.76,30.48 97.6,40.64
  Top 0.406: OV7670.D4 111.12,30.48 | 97.6,40.64 ARDUINO-MEGA1.33
OV_D5
  Top 0.203: 95.25,39.37 97.57,39.37 107.73,29.21
  Top 0.406: ARDUINO-MEGA1.32 95.25,39.37 | 107.73,29.21 OV7670.D5
OV_D6
  Top 0.203: 111.12,33.02 107.63,33.02 97.47,43.18
  Top 0.406: OV7670.D6 111.12,33.02 | 97.47,43.18 ARDUINO-MEGA1.31
OV_D7
  Top 0.203: 95.25,41.91 97.6,41.91 107.76,31.75
  Top 0.406: ARDUINO-MEGA1.30 95.25,41.91 | 107.76,31.75 OV7670.D7
PCLK  (via drill 0.35)
  Top 0.406: OV7670.PCLK 107.63,34.29 101.92,40 101.92,56.83 100.97,57.78 92.08,57.78 90.81,56.52 90.81,53.98 89.53,52.7 67.94,52.7 66.99,51.75 46.67,51.75 v45.72,50.8
  Bottom 0.406: ARDUINO-MEGA1.7 v45.72,50.8
RX2
  Bottom 0.406: ARDUINO-MEGA1.RX2-17 76.2,57.63 78.26,59.69 102.87,59.69 105.09,57.47 123.51,57.47 126.82,60.78 130.23,60.78 130.87,60.13 ESP-01S.2
SCL
  Top 0.406: ARDUINO-MEGA1.SCL-21 86.36,57.78 88.11,59.54 105.56,59.54 108.7,56.4 108.7,45.2 107,43.5 105.41,43.5 104.95,43.04 104.95,40.46 | 104.95,40.46 R20.1 | OV7670.SCL 105.41,39.37 104.95,39.82 104.95,40.46
SDA
  Top 0.406: 115.57,39.37 OV7670.SDA | 115.57,39.37 R21.1 | 115.57,39.37 117,39.37 117,43.34 114.78,45.56 110.33,45.56 109.54,46.35 109.54,57.15 106.29,60.4 85.8,60.4 83.82,58.42 ARDUINO-MEGA1.SDA-20
SDCARD-CS
  Top 0.406: ARDUINO-MEGA1.53 95.25,13.97 91.12,13.97 90.77,13.62 62.07,13.62 55.88,19.81 55.88,31.43 58.74,34.29 SDCARD.1
SDCARD-MISO
  Top 0.406: ARDUINO-MEGA1.50 90.17,17.78 88.58,16.19 63.98,16.19 63.18,16.99 63.18,25.88 62.39,26.67 SDCARD.4
SDCARD-MOSI
  Top 0.406: ARDUINO-MEGA1.51 95.25,16.51 90.49,16.51 89.35,15.37 63.05,15.37 57.78,20.64 57.78,28.26 58.74,29.21 SDCARD.3
SDCARD-SCK
  Top 0.406: ARDUINO-MEGA1.52 90.81,15.24 90.06,14.5 62.62,14.5 56.83,20.28 56.83,29.84 58.74,31.75 SDCARD.2
SENS0
  Top 0.305: ARDUINO-MEGA1.A0 50.8,6.83 49.69,5.71 20.95,5.71 20.64,6.03 20.64,9.53 21.27,10.16 S1.2
  Bottom 0.305: R30.2 S1.2
SENS1
  Top 0.305: ARDUINO-MEGA1.A1 53.34,6.83 51.59,5.08 20.48,5.08 19.84,5.71 19.84,11.27 21.27,12.7 S1.3
  Bottom 0.305: R31.2 S1.3
SENS2
  Top 0.305: ARDUINO-MEGA1.A2 55.88,6.83 53.5,4.45 14.76,4.45 14.29,4.92 14.29,9.37 14.92,10 16.35,10 S2.2
  Bottom 0.305: R33.2 S2.2
SENS3
  Top 0.305: ARDUINO-MEGA1.A3 58.42,6.83 55.4,3.81 14.29,3.81 13.49,4.6 13.49,11.27 14.92,12.7 S2.3
  Bottom 0.305: R34.2 S2.3
SENS4
  Top 0.305: ARDUINO-MEGA1.A4 60.96,6.83 57.31,3.17 8.57,3.17 7.94,3.81 7.94,9.53 8.57,10.16 S3.2
  Bottom 0.305: R36.2 S3.2
SENS5
  Top 0.305: ARDUINO-MEGA1.A5 63.5,6.83 59.21,2.54 8.1,2.54 7.14,3.49 7.14,11.27 8.57,12.7 S3.3
  Bottom 0.305: R37.2 S3.3
SENS6
  Top 0.305: ARDUINO-MEGA1.A6 66.04,6.83 61.12,1.91 4.76,1.91 1.91,4.76 1.91,9.68 2.38,10.16 S4.2
  Bottom 0.305: R39.2 S4.2
SENS7
  Top 0.305: ARDUINO-MEGA1.A7 68.58,6.99 62.76,1.17 4.29,1.17 1.17,4.29 1.17,11.65 2.22,12.7 S4.3
  Bottom 0.305: R40.2 S4.3
SENS8
  Top 0.305: ARDUINO-MEGA1.A8 73.66,8.57 72.87,9.37 38.26,9.37 34.29,13.34 S5.2
  Bottom 0.305: R42.2 S5.2
SENS9
  Top 0.305: ARDUINO-MEGA1.A9 76.2,9.05 75.25,10 40.32,10 36.83,13.49 S5.3
  Bottom 0.305: R43.2 S5.3
SENS10
  Top 0.305: ARDUINO-MEGA1.A10 78.74,9.37 77.47,10.64 50.16,10.64 48.26,12.54 S6.2
  Bottom 0.305: S6.2 R45.2
SENS11
  Top 0.305: ARDUINO-MEGA1.A11 81.28,9.84 79.85,11.27 52.07,11.27 50.8,12.54 S6.3
  Bottom 0.305: S6.3 R46.2
SENS12
  Bottom 0.305: R48.2 S7.2 95.73,7.62 93.5,5.4 84.45,5.4 83.82,6.03 ARDUINO-MEGA1.A12
SENS13
  Top 0.305: ARDUINO-MEGA1.A13 86.36,8.57 87,9.21 101.76,9.21 102.71,10.16 S7.3
  Bottom 0.305: R49.2 S7.3
SENS14
  Top 0.305: ARDUINO-MEGA1.A14 88.9,3.65 89.85,2.7 107.95,2.7 108.43,3.17 108.43,6.67 109.38,7.62 S8.2
  Bottom 0.305: R51.2 S8.2
SENS15
  Top 0.305: S8.3 108.9,10.16 107.63,8.89 107.63,3.97 107,3.33 91.76,3.33 91.44,3.65 ARDUINO-MEGA1.A15
  Bottom 0.305: S8.3 R52.2
TX2  (via drill 0.25)
  Top 0.406: R25.1 122.24,51.43 121.92,51.75 v121.92,59.05
  Bottom 0.406: ARDUINO-MEGA1.TX2-16 73.66,58.26 76.07,60.67 103.16,60.67 105.41,58.42 121.28,58.42 v121.92,59.05
VSYNC
  Top 0.406: ARDUINO-MEGA1.9 39.05,55.82 39.05,53.02 39.37,52.7 66.04,52.7 67.31,53.98 88.9,53.98 89.53,54.61 89.53,57.15 91.05,58.66 101.36,58.66 102.87,57.15 102.87,40.48 106.52,36.83 OV7670.VSYNC
XCLK
  Top 0.406: ARDUINO-MEGA1.6 48.26,57.15 49.21,58.1 65.57,58.1 69.62,62.15 107.23,62.15 111.37,58.02 111.37,47.38 111.6,47.15 115.89,47.15 118.75,44.29 118.75,38.26 117,36.51 115.42,36.51 R23.2
XCLK1
  Top 0.406: R23.1 114.44,34.74 114.3,34.61 114.3,34.29 | R22.2 114.56,33.71 114.3,33.97 114.3,34.29 | OV7670.XCLK 114.3,34.29
(copper drawn outside any net)
  shapes: Top area x4

### Text on the board
tPlace: Shield / #P1000 | Rev.20/05/2021
bPlace: GND / / +9V | 639,479 | 0,0 | + | + | + | + | + | + | + | +